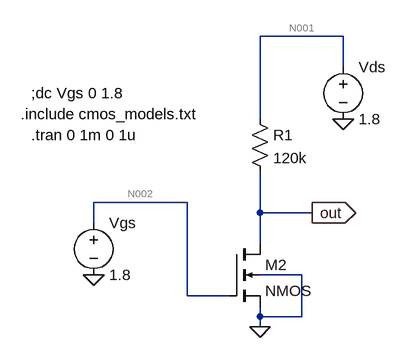
[diagram p0: schematic resistive-load-inverter.asc]
resistive-load-inverter.asc, the LTspice schematic file:
Version 4
SHEET 1 1448 4096
WIRE 304 -48 176 -48
WIRE 304 0 304 -48
WIRE 176 80 176 -48
WIRE 64 208 -80 208
WIRE 176 224 176 160
WIRE 256 224 176 224
WIRE -80 240 -80 208
WIRE 176 272 176 224
WIRE 240 320 176 320
WIRE 64 352 64 208
WIRE 128 352 64 352
WIRE 176 384 176 368
WIRE 240 384 240 320
WIRE 240 384 176 384
WIRE 176 400 176 384
FLAG 304 80 0
FLAG -80 320 0
FLAG 176 400 0
FLAG 256 224 out
IOPIN 256 224 Out
SYMBOL voltage 304 -16 R0
WINDOW 123 0 0 Left 0
WINDOW 39 0 0 Left 0
SYMATTR InstName Vds
SYMATTR Value 1.8
SYMBOL voltage -80 224 R0
WINDOW 123 0 0 Left 0
WINDOW 39 0 0 Left 0
SYMATTR InstName Vgs
SYMATTR Value 1.8
SYMBOL nmos4 128 272 R0
SYMATTR InstName M2
SYMATTR Value2 l=50 w=500
SYMBOL res 160 64 R0
SYMATTR InstName R1
SYMATTR Value 120k
TEXT -176 40 Left 2 !;dc Vgs 0 1.8
TEXT -192 72 Left 2 !.include cmos_models.txt
TEXT -176 104 Left 2 !.tran 0 1m 0 1u

The netlist it stands for:
* resistive-load-inverter.asc
Vds N001 0 1.8
Vgs N002 0 1.8
M2 out N002 0 0 NMOS l=50 w=500
R1 N001 out 120k
.model NMOS NMOS
.model PMOS PMOS
.lib standard.mos
;dc Vgs 0 1.8
.include cmos_models.txt
.tran 0 1m 0 1u
.backanno
.end

* Results of the author's LTspice run, read from the files saved beside the schematic
* Operating Point, zero values left out:
*   V(n001) = 1.8 V
*   V(n002) = 1.8 V
*   V(out) = 41.18 mV
*   Id(M2) = 14.66 µA
*   Is(M2) = -14.66 µA
*   I(R1) = 14.66 µA
*   I(Vds) = -14.66 µA